# Altium schematic sheet Analog.SchDoc
size A
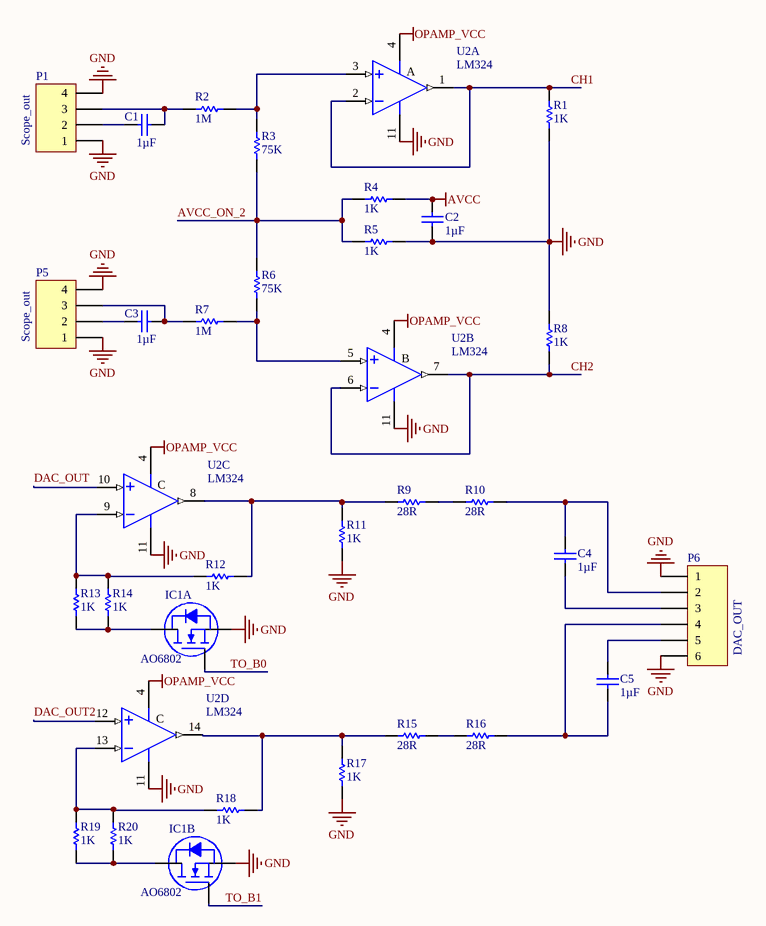
[diagram p0: Analog.SchDoc]

## Parts
C1  1µF  [CAPC200X125X75L45N]
C2  1µF  [CAPC200X125X75L45N]
C3  1µF  [CAPC200X125X75L45N]
C4  1µF  [CAPC200X125X75L45N]
C5  1µF  [CAPC200X125X75L45N]
IC1  AO6802  [ALPHAOMEGA TSOP-6]  (parts A,B of 2)
P1  Scope_out  [HDR1X4]
P5  Scope_out  [HDR1X4]
P6  DAC_OUT  [HDR1X6]
R1  1K  [RESC200X125X50L35N]
R2  1M  [RESC200X125X50L35N]
R3  75K  [RESC200X125X50L35N]
R4  1K  [RESC200X125X50L35N]
R5  1K  [RESC200X125X50L35N]
R6  75K  [RESC200X125X50L35N]
R7  1M  [RESC200X125X50L35N]
R8  1K  [RESC200X125X50L35N]
R9  28R  [RESC160X80X55L25N]
R10  28R  [RESC160X80X55L25N]
R11  1K  [RESC200X125X50L35N]
R12  1K  [RESC200X125X50L35N]
R13  1K  [RESC200X125X50L35N]
R14  1K  [RESC200X125X50L35N]
R15  28R  [RESC160X80X55L25N]
R16  28R  [RESC160X80X55L25N]
R17  1K  [RESC200X125X50L35N]
R18  1K  [RESC200X125X50L35N]
R19  1K  [RESC200X125X50L35N]
R20  1K  [RESC200X125X50L35N]
U2  LM324  [SOIC14P127_865X600X175L83X41N]  (parts A,B,C,D of 4)

## Nets
AVCC: C2.2 R4.2
GND: C2.1 IC1.2(S2) IC1.5(S1) P1.1 P1.4 P5.1 P5.4 P6.1 P6.6 R1.1 R5.2 R8.2 R11.1 R17.1 U2.11(V-)
OPAMP_VCC: U2.4(V+)
AVCC_ON_2: R3.1 R4.1 R5.1 R6.2
CH1: R1.2 U2.1(OUTA) U2.2(IN-)
CH2: R8.1 U2.6(IN-) U2.7(OUTB)
DAC_OUT: U2.10(IN+)
DAC_OUT2: U2.12(IN+)
TO_B0: IC1.1(G1)
TO_B1: IC1.3(G2)
NetC1_1: C1.1 P1.2
NetC1_2: C1.2 P1.3 R2.1
NetC3_1: C3.1 P5.2
NetC3_2: C3.2 P5.3 R7.1
NetC4_1: C4.1 P6.3
NetC4_2: C4.2 P6.2 R10.2
NetC5_1: C5.1 P6.4 R16.2
NetC5_2: C5.2 P6.5
NetIC1_4: IC1.4(D2) R19.2 R20.2
NetIC1_6: IC1.6(D1) R13.1 R14.1
NetR2_2: R2.2 R3.2 U2.3(IN+)
NetR6_1: R6.1 R7.2 U2.5(IN+)
NetR9_1: R9.1 R11.2 R12.1 U2.8(OUTC)
NetR9_2: R9.2 R10.1
NetR12_2: R12.2 R13.2 R14.2 U2.9(IN-)
NetR15_1: R15.1 R17.2 R18.2 U2.14(OUTD)
NetR15_2: R15.2 R16.1
NetR18_1: R18.1 R19.1 R20.1 U2.13(IN-)

## Notes on the sheet
- (in symbol LM324MX, part A) A
- (in symbol LM324MX, part B) B
- (in symbol LM324MX, part C) C
- (in symbol LM324MX, part D) C

## Library data of the parts
C1-C5 = 885012107015: 1µF 25V Ceramic Capacitor X5R 0805 (2012 Metric) 0.079" L x 0.049" W (2.00mm x 1.25mm); Manufacturer: Wurth Electronics; Capacitance: 1uF; Tolerance: 20%; Supplier 1: Farnell; Manufacturer Part Number: 885012107015; Stock 1: 0; Mount: Surface Mount; Case/Package: 0805; Case Code (Metric): 2012; Case Code (Imperial): 0805; Min Operating Temperature: -55°C; Max Operating Temperature: 85°C; Packaging: Tape and Reel; Voltage Rating: 25V; Length: 0.079inch; Width: 0.049inch; Thickness: 0.053inch
IC1 = ALPHAOMEGA TSOP-6: MOSFET 2N-CH 30V 3.5A 6-TSOP; Manufacturer: Alpha & Omega; Rds On (Max) at Id, Vgs: 50 mOhm @ 3.5A, 10V; Vgs(th) (Max) at Id: 2.5V @ 250µA; Gate Charge (Qg): 5nC @ 10V; Input Capacitance (Ciss) at Vds: 210pF @ 15V; Power - Max: 1.15W; Part Number: AO6802; PartId: 9696; Supplier 1: Digi-Key; Supplier Part Number 1: 785-1082-1-ND; ComponentLink1Description: Datasheet; ComponentLink1URL: http://aosmd.com/res/data_sheets/AO6802.pdf; ComponentLink2Description: Digi-Key Listing; ComponentLink2URL: https://www.digikey.com/product-detail/en/alpha-omega-semiconductor-inc/AO6802/785-1082-1-ND/1856025; Price: 0.17; Type: 2 N-Channel (Dual); Device Package: SC-74, SOT-457; Drain to Source Voltage (Vdss): 30V; Features: Logic Level Gate; Current Continuous Drain: 3.5A
P1 P5 = Header 4: Header, 4-Pin; LatestRevisionDate: 17-Jul-2002; LatestRevisionNote: Re-released for DXP Platform.; Publisher: Altium Limited
P6 = Header 6: Header, 6-Pin; LatestRevisionDate: 17-Jul-2002; LatestRevisionNote: Re-released for DXP Platform.; Publisher: Altium Limited
R1 R4 R5 R8 R11-R14 R17-R20 = RC0805FR-071KL: RES SMD 1K OHM 1% 1/8W 0805; Manufacturer: Yageo; Power (Watts): 0.125W, 1/8W; Temperature Coefficient: ±100ppm/°C; Supplier 1: Digi-Key; Manufacturer Part Number: RC0805FR-071KL; RoHS: RoHS Compliant; Category: Resistors; Stock 1: 6960895; Pricing 1: 1=0.1, 10=0.019, 25=0.0136, 50=0.0104, 100=0.0077, 250=0.00584, 500=0.00468, 1000=0.00345 (USD); Packaging: Cut Tape (CT); Part Status: Active; Resistance (Ohms): 1k; Tolerance: ±1%; Composition: Thick Film; Features: Moisture Resistant; Operating Temperature: -55°C ~ 155°C; Package / Case: 0805 (2012 Metric); Supplier Device Package: 0805; Size / Dimension: 0.079" L x 0.049" W (2.00mm x 1.25mm); Height - Seated (Max): 0.024" (0.60mm); Number of Terminations: 2; Failure Rate: -; ComponentLink1URL: http://www.yageo.com/NewPortal/yageodocoutput?fileName=/pdf/R-Chip/PYu-RC_Group_51_RoHS_L_4.pdf; ComponentLink1Description: http://www.yageo.com/NewPortal/yageodocoutput?fileName=/pdf/R-Chip/PYu-RC_Group_51_RoHS_L_4.pdf
R2 R7 = RC0805JR-071ML: RES SMD 1M OHM 5% 1/8W 0805; Manufacturer: Yageo; Resistance: 1MR; Temperature Coefficient: 100ppm/°C; Power Rating: 125mW; Voltage Rating: 150V; Supplier 1: Future Electronics; Manufacturer Part Number: RC0805JR-071ML; Stock 1: 0; Case/Package: 0805; Case Code (Imperial): 0805; Case Code (Metric): 2012; Contact Plating: Lead,Matte,Tin; Min Operating Temperature: -55°C; Max Operating Temperature: 155°C; Tolerance: 5%; Composition: Thick Film; Packaging: Tape and Reel; Package Quantity: 1; Termination: SMD/SMT; Number of Terminations: 2; Military Standard: Not; Max Power Dissipation: 125mW; Features: Moisture Resistant; Length: 0.079inch; Height: 0.024inch; Width: 0.049inch; Depth: 1.25mm; Radiation Hardening: No; REACH SVHC: Unknown; Lead Free: Lead Free; ComponentLink1URL: http://www.yageo.com/documents/recent/PYu-RC_Group_51_RoHS_L_9.pdf; ComponentLink1Description: http://www.yageo.com/documents/recent/PYu-RC_Group_51_RoHS_L_9.pdf; ComponentLink2URL: http://www.yageo.ru/pdf/RC0805.pdf; ComponentLink2Description: http://www.yageo.ru/pdf/RC0805.pdf; ComponentLink3URL: http://www.farnell.com/datasheets/442941.pdf; ComponentLink3Description: http://www.farnell.com/datasheets/442941.pdf; ComponentLink4URL: http://www.farnell.com/datasheets/444164.pdf; ComponentLink4Description: http://www.farnell.com/datasheets/444164.pdf
R3 R6 = RT0805FRE0775KL: RES SMD 75K OHM 1% 1/8W 0805; Manufacturer: Yageo; Resistance: 75kR; Temperature Coefficient: 50ppm/°C; Power Rating: 125mW; Voltage Rating: 150V; Supplier 1: Arrow; Manufacturer Part Number: RT0805FRE0775KL; Stock 1: 0; Case/Package: 0805; Weight: 0.000194oz; Contact Plating: Matte,Tin; Case Code (Metric): 2012; Case Code (Imperial): 0805; Min Operating Temperature: -55°C; Max Operating Temperature: 125°C; Tolerance: 1%; Composition: Thin Film; Package Quantity: 5000; Packaging: Tape and Reel; Number of Terminations: 2; Termination: SMD/SMT; Military Standard: Not; Max Power Dissipation: 125mW; Voltage Rating (DC): 150V; Length: 2mm; Height: 0.024inch; Width: 0.049inch; Depth: 1.25mm; Radiation Hardening: No; Lead Free: Lead Free; ComponentLink1URL: http://www.yageo.com/documents/recent/PYu-RT_1-to-0.01_RoHS_L_8.pdf; ComponentLink1Description: http://www.yageo.com/documents/recent/PYu-RT_1-to-0.01_RoHS_L_8.pdf; ComponentLink2URL: http://www.mouser.com/ds/2/447/yageodocoutput-1125656.pdf; ComponentLink2Description: http://www.mouser.com/ds/2/447/yageodocoutput-1125656.pdf
R9 R10 R15 R16 = RC0603FR-0728RL: RES SMD 28 OHM 1% 1/10W 0603; Manufacturer: Yageo; Temperature Coefficient: 100ppm/°C; Power Rating: 100mW; Voltage Rating: 50V; Supplier 1: Future Electronics; Manufacturer Part Number: RC0603FR-0728RL; Stock 1: 0; Case/Package: 0603; Contact Plating: Matte,Tin; Case Code (Metric): 1608; Case Code (Imperial): 0603; Min Operating Temperature: -55°C; Max Operating Temperature: 155°C; Resistance: 28R; Tolerance: 1%; Composition: Thick Film; Package Quantity: 1; Packaging: Tape and Reel; Number of Terminations: 2; Termination: SMD/SMT; Military Standard: Not; Max Power Dissipation: 100mW; Voltage Rating (DC): 50V; Features: Moisture Resistant; Length: 0.063inch; Height: 0.022inch; Width: 0.031inch; Depth: 0.8mm; Lead Free: Lead Free; ComponentLink1URL: http://www.yageo.com/documents/recent/PYu-RC_Group_51_RoHS_L_9.pdf; ComponentLink1Description: http://www.yageo.com/documents/recent/PYu-RC_Group_51_RoHS_L_9.pdf; ComponentLink2URL: http://www.yageo.com/documents/recent/PYu-RC0603_51_RoHS_L_4.pdf; ComponentLink2Description: http://www.yageo.com/documents/recent/PYu-RC0603_51_RoHS_L_4.pdf
U2 = LM324MX: IC OPAMP GP 14SOIC; Manufacturer: ON Semiconductor / Fairchild; Min Supply Voltage: 3V; Max Supply Voltage: 32V; Min Dual Supply Voltage: 1.5V; Max Dual Supply Voltage: 16V; Voltage Gain: 100dB; Number of Channels: 4; Common Mode Rejection Ratio: 65dB; Output Current: 40mA; Input Bias Current: 250nA; Input Offset Voltage (Vos): 7mV; Nominal Supply Current: 1.2mA; Operating Supply Current: 1mA; Power Dissipation: 640mW; Min Input Voltage: -300mV; Max Frequency: 20kHz; Supplier 1: Future Electronics; Manufacturer Part Number: LM324MX; Stock 1: 0; Mount: Surface Mount; Case/Package: SOP; Number of Pins: 14; Weight: 0.2183g; Contact Plating: Matte,Tin; Min Operating Temperature: 0°C; Max Operating Temperature: 70°C; Packaging: Tape and Reel; Number of Circuits: 4; Package Quantity: 3000; Output Current per Channel: 40mA; Number of Elements: 4; Power Supply Rejection Ratio (PSRR): 65dB; Operating Supply Voltage: 32V; Number of Amplifiers: 4; Max Power Dissipation: 640mW; Max Input Voltage: 32V; Length: 8.76mm; Height: 1.65mm; Width: 4.2mm; Radiation Hardening: No; REACH SVHC: No SVHC; Lead Free: Lead Free; ComponentLink1URL: https://www.fairchildsemi.com/datasheets/LM/LM2902.pdf; ComponentLink1Description: https://www.fairchildsemi.com/datasheets/LM/LM2902.pdf; ComponentLink2URL: http://www.fairchildsemi.com/datasheets/LM/LM324.pdf; ComponentLink2Description: http://www.fairchildsemi.com/datasheets/LM/LM324.pdf; ComponentLink3URL: https://www.fairchildsemi.com/datasheets/LM/LM324.pdf; ComponentLink3Description: https://www.fairchildsemi.com/datasheets/LM/LM324.pdf; ComponentLink4URL: http://www.fairchildsemi.com/ds/LM/LM2902.pdf; ComponentLink4Description: http://www.fairchildsemi.com/ds/LM/LM2902.pdf; ComponentLink5URL: http://www.fairchildsemi.com/ds/LM/LM324.pdf; ComponentLink5Description: http://www.fairchildsemi.com/ds/LM/LM324.pdf; ComponentLink6URL: http://datasheet.iiic.cc/fairchild/LM324MX.pdf; ComponentLink6Description: http://datasheet.iiic.cc/fairchild/LM324MX.pdf